# EAGLE design umotion_2_v1.2_pcb_1 (EAGLE 9.5.2)

## Sheet 1 of 2
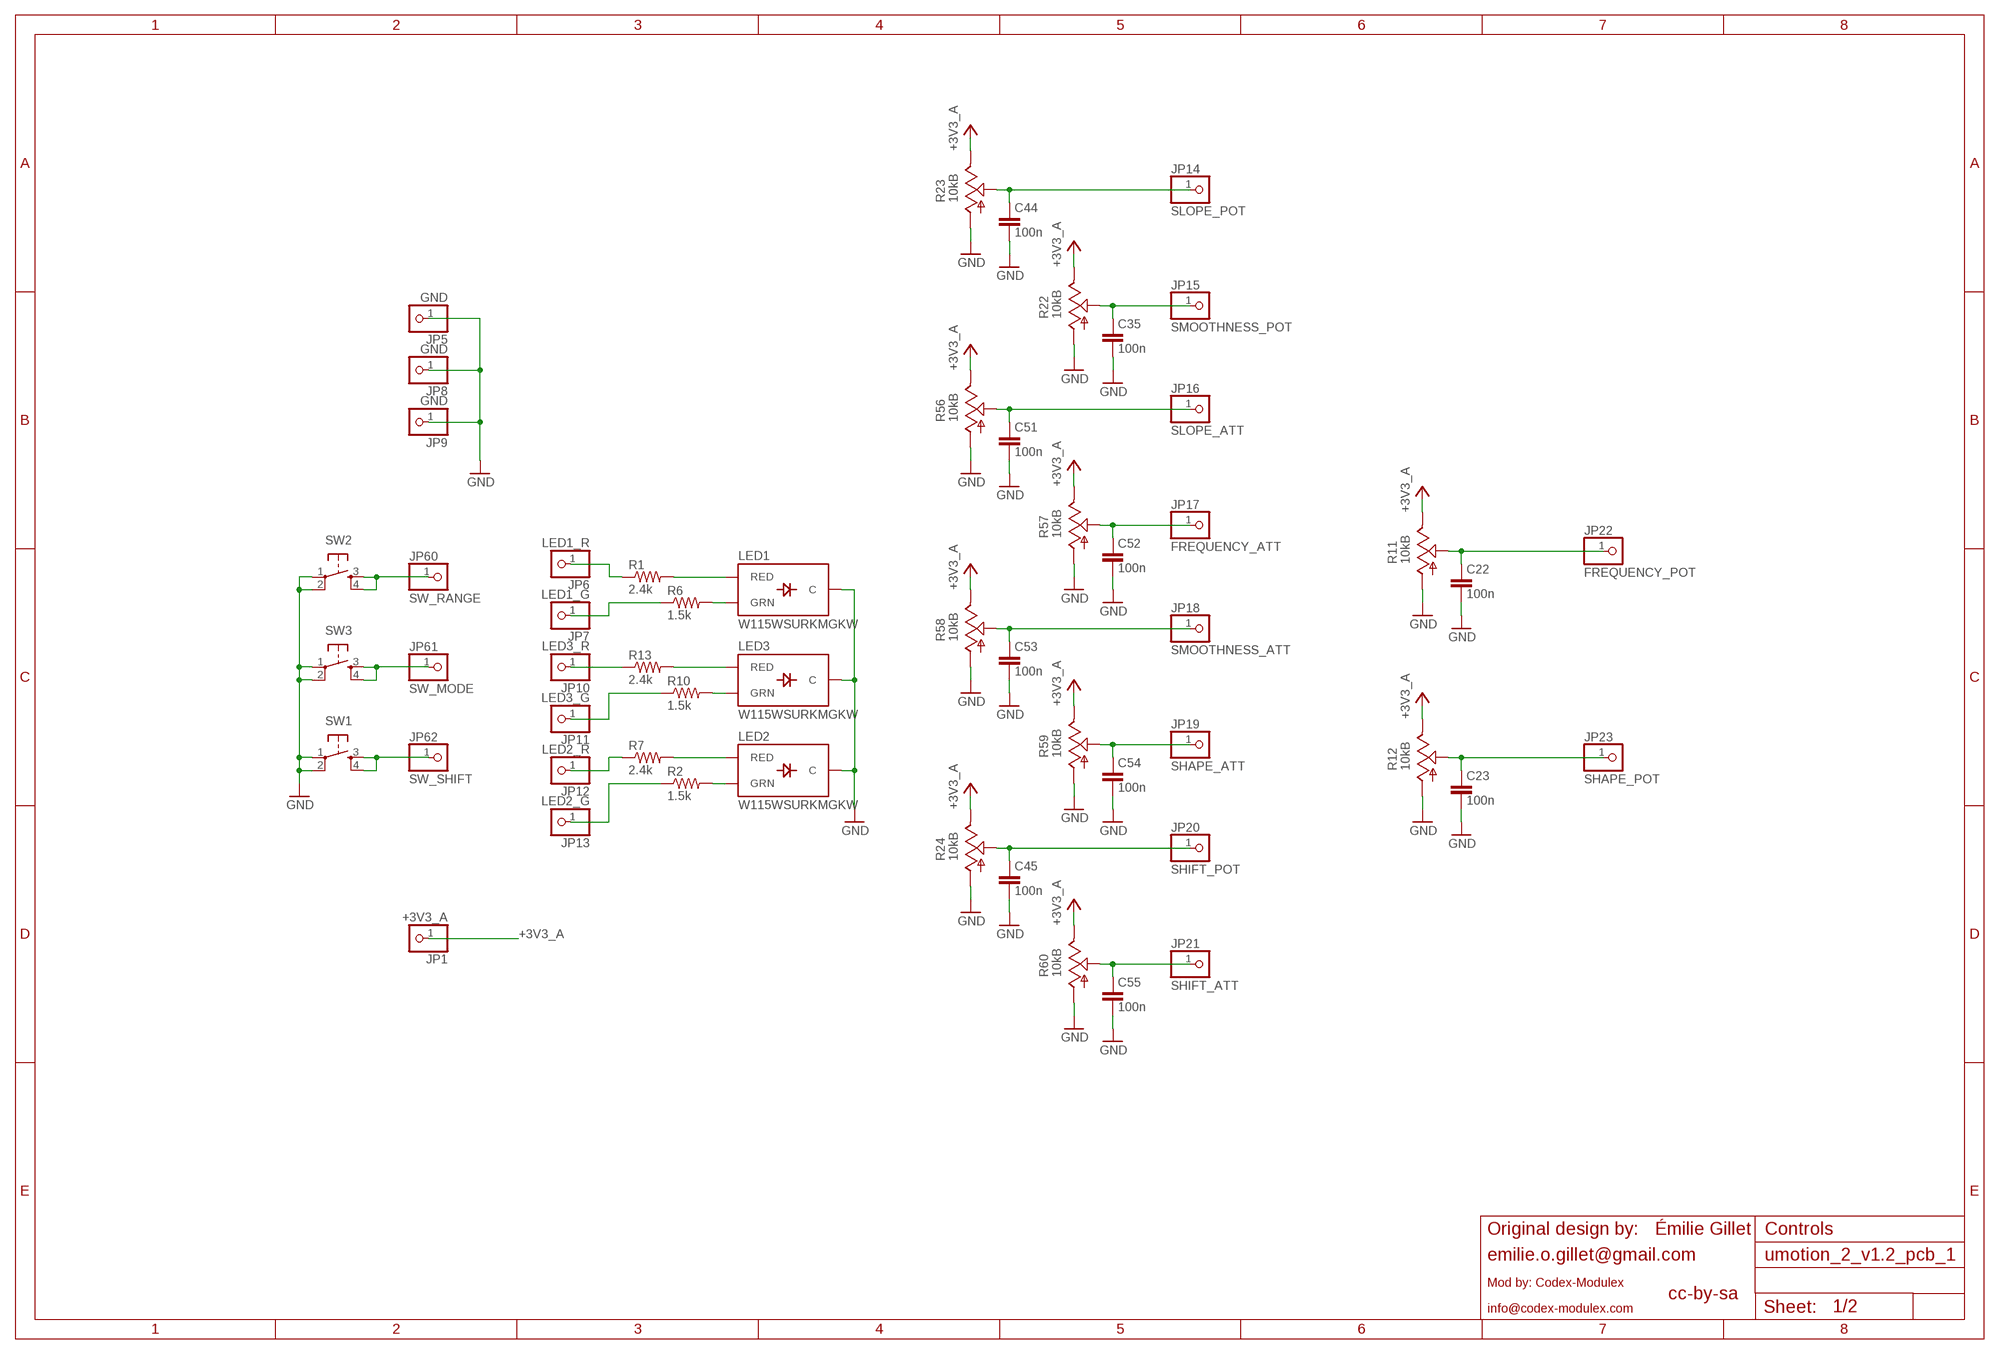
[diagram p0: schematic, sheet 1]

### Parts
C22  100n  PARTS_AMAN_CAPACITOR  [PARTS_AMAN_RESISTOR_0603]
C23  100n  PARTS_AMAN_CAPACITOR  [PARTS_AMAN_RESISTOR_0603]
C35  100n  PARTS_AMAN_CAPACITOR  [PARTS_AMAN_RESISTOR_0603]
C44  100n  PARTS_AMAN_CAPACITOR  [PARTS_AMAN_RESISTOR_0603]
C45  100n  PARTS_AMAN_CAPACITOR  [PARTS_AMAN_RESISTOR_0603]
C51  100n  PARTS_AMAN_CAPACITOR  [PARTS_AMAN_RESISTOR_0603]
C52  100n  PARTS_AMAN_CAPACITOR  [PARTS_AMAN_RESISTOR_0603]
C53  100n  PARTS_AMAN_CAPACITOR  [PARTS_AMAN_RESISTOR_0603]
C54  100n  PARTS_AMAN_CAPACITOR  [PARTS_AMAN_RESISTOR_0603]
C55  100n  PARTS_AMAN_CAPACITOR  [PARTS_AMAN_RESISTOR_0603]
JP1  +3V3_A  PARTS_AMAN_PINHD-1X1  [PARTS_AMAN_1X01]
JP5  GND  PARTS_AMAN_PINHD-1X1  [PARTS_AMAN_1X01]
JP6  LED1_R  PARTS_AMAN_PINHD-1X1  [PARTS_AMAN_1X01]
JP7  LED1_G  PARTS_AMAN_PINHD-1X1  [PARTS_AMAN_1X01]
JP8  GND  PARTS_AMAN_PINHD-1X1  [PARTS_AMAN_1X01]
JP9  GND  PARTS_AMAN_PINHD-1X1  [PARTS_AMAN_1X01]
JP10  LED3_R  PARTS_AMAN_PINHD-1X1  [PARTS_AMAN_1X01]
JP11  LED3_G  PARTS_AMAN_PINHD-1X1  [PARTS_AMAN_1X01]
JP12  LED2_R  PARTS_AMAN_PINHD-1X1  [PARTS_AMAN_1X01]
JP13  LED2_G  PARTS_AMAN_PINHD-1X1  [PARTS_AMAN_1X01]
JP14  SLOPE_POT  PARTS_AMAN_PINHD-1X1  [PARTS_AMAN_1X01]
JP15  SMOOTHNESS_POT  PARTS_AMAN_PINHD-1X1  [PARTS_AMAN_1X01]
JP16  SLOPE_ATT  PARTS_AMAN_PINHD-1X1  [PARTS_AMAN_1X01]
JP17  FREQUENCY_ATT  PARTS_AMAN_PINHD-1X1  [PARTS_AMAN_1X01]
JP18  SMOOTHNESS_ATT  PARTS_AMAN_PINHD-1X1  [PARTS_AMAN_1X01]
JP19  SHAPE_ATT  PARTS_AMAN_PINHD-1X1  [PARTS_AMAN_1X01]
JP20  SHIFT_POT  PARTS_AMAN_PINHD-1X1  [PARTS_AMAN_1X01]
JP21  SHIFT_ATT  PARTS_AMAN_PINHD-1X1  [PARTS_AMAN_1X01]
JP22  FREQUENCY_POT  PARTS_AMAN_PINHD-1X1  [PARTS_AMAN_1X01]
JP23  SHAPE_POT  PARTS_AMAN_PINHD-1X1  [PARTS_AMAN_1X01]
JP60  SW_RANGE  PARTS_AMAN_PINHD-1X1  [PARTS_AMAN_1X01]
JP61  SW_MODE  PARTS_AMAN_PINHD-1X1  [PARTS_AMAN_1X01]
JP62  SW_SHIFT  PARTS_AMAN_PINHD-1X1  [PARTS_AMAN_1X01]
LED1  W115WSURKMGKW  LED-BICOLOR-THROUGHHOLE2.54  [LED-BICOLOR-THROUGHHOLE-2.54]
LED2  W115WSURKMGKW  LED-BICOLOR-THROUGHHOLE2.54  [LED-BICOLOR-THROUGHHOLE-2.54]
LED3  W115WSURKMGKW  LED-BICOLOR-THROUGHHOLE2.54  [LED-BICOLOR-THROUGHHOLE-2.54]
R1  2.4k  PARTS_AMAN_RESISTOR  [PARTS_AMAN_RESISTOR_0603]
R2  1.5k  PARTS_AMAN_RESISTOR  [PARTS_AMAN_RESISTOR_0603]
R6  1.5k  PARTS_AMAN_RESISTOR  [PARTS_AMAN_RESISTOR_0603]
R7  2.4k  PARTS_AMAN_RESISTOR  [PARTS_AMAN_RESISTOR_0603]
R10  1.5k  PARTS_AMAN_RESISTOR  [PARTS_AMAN_RESISTOR_0603]
R11  10kB  POT_USVERTICAL  [ALPS_POT_VERTICAL]
R12  10kB  POT_USVERTICAL  [ALPS_POT_VERTICAL]
R13  2.4k  PARTS_AMAN_RESISTOR  [PARTS_AMAN_RESISTOR_0603]
R22  10kB  POT_USVERTICAL  [ALPS_POT_VERTICAL]
R23  10kB  POT_USVERTICAL  [ALPS_POT_VERTICAL]
R24  10kB  POT_USVERTICAL  [ALPS_POT_VERTICAL]
R56  10kB  POT_USVERTICAL  [ALPS_POT_VERTICAL]
R57  10kB  POT_USVERTICAL  [ALPS_POT_VERTICAL]
R58  10kB  POT_USVERTICAL  [ALPS_POT_VERTICAL]
R59  10kB  POT_USVERTICAL  [ALPS_POT_VERTICAL]
R60  10kB  POT_USVERTICAL  [ALPS_POT_VERTICAL]
SW1  TAC_SWITCHPTH  [TACTILE-PTH]
SW2  TAC_SWITCHPTH  [TACTILE-PTH]
SW3  TAC_SWITCHPTH  [TACTILE-PTH]

### Nets
+3V3_A: JP1.1 R11.P$1(E) R12.P$1(E) R22.P$1(E) R23.P$1(E) R24.P$1(E) R56.P$1(E) R57.P$1(E) R58.P$1(E) R59.P$1(E) R60.P$1(E)
GND: C22.2 C23.2 C35.2 C44.2 C45.2 C51.2 C52.2 C53.2 C54.2 C55.2 JP5.1 JP8.1 JP9.1 LED1.2(C) LED2.2(C) LED3.2(C) R11.P$3(A) R12.P$3(A) R22.P$3(A) R23.P$3(A) R24.P$3(A) R56.P$3(A) R57.P$3(A) R58.P$3(A) R59.P$3(A) R60.P$3(A) SW1.1 SW1.2 SW2.1 SW2.2 SW3.1 SW3.2 ; also sheet 2
LED_MODE_G: JP11.1 R10.1
LED_MODE_R: JP10.1 R13.1
LED_RANGE_G: JP7.1 R6.1
LED_RANGE_R: JP6.1 R1.1
LED_SHIFT_G: JP13.1 R2.1
LED_SHIFT_R: JP12.1 R7.1
N$1: C44.1 JP14.1 R23.P$2(S)
N$5: C35.1 JP15.1 R22.P$2(S)
N$6: C51.1 JP16.1 R56.P$2(S)
N$7: C52.1 JP17.1 R57.P$2(S)
N$8: C53.1 JP18.1 R58.P$2(S)
N$9: C54.1 JP19.1 R59.P$2(S)
N$10: C45.1 JP20.1 R24.P$2(S)
N$11: C55.1 JP21.1 R60.P$2(S)
N$16: LED1.3(RED) R1.2
N$18: LED3.3(RED) R13.2
N$20: LED3.1(GRN) R10.2
N$21: LED2.3(RED) R7.2
N$22: LED1.1(GRN) R6.2
N$23: LED2.1(GRN) R2.2
N$30: C22.1 JP22.1 R11.P$2(S)
N$31: C23.1 JP23.1 R12.P$2(S)
SW_MODE: JP61.1 SW3.3 SW3.4
SW_RANGE: JP60.1 SW2.3 SW2.4
SW_SHIFT: JP62.1 SW1.3 SW1.4

### Notes on the sheet
- Original design by: | Émilie Gillet | Controls
- emilie.o.gillet@gmail.com
- Mod by: Codex-Modulex
- cc-by-sa
- info@codex-modulex.com

## Sheet 2 of 2
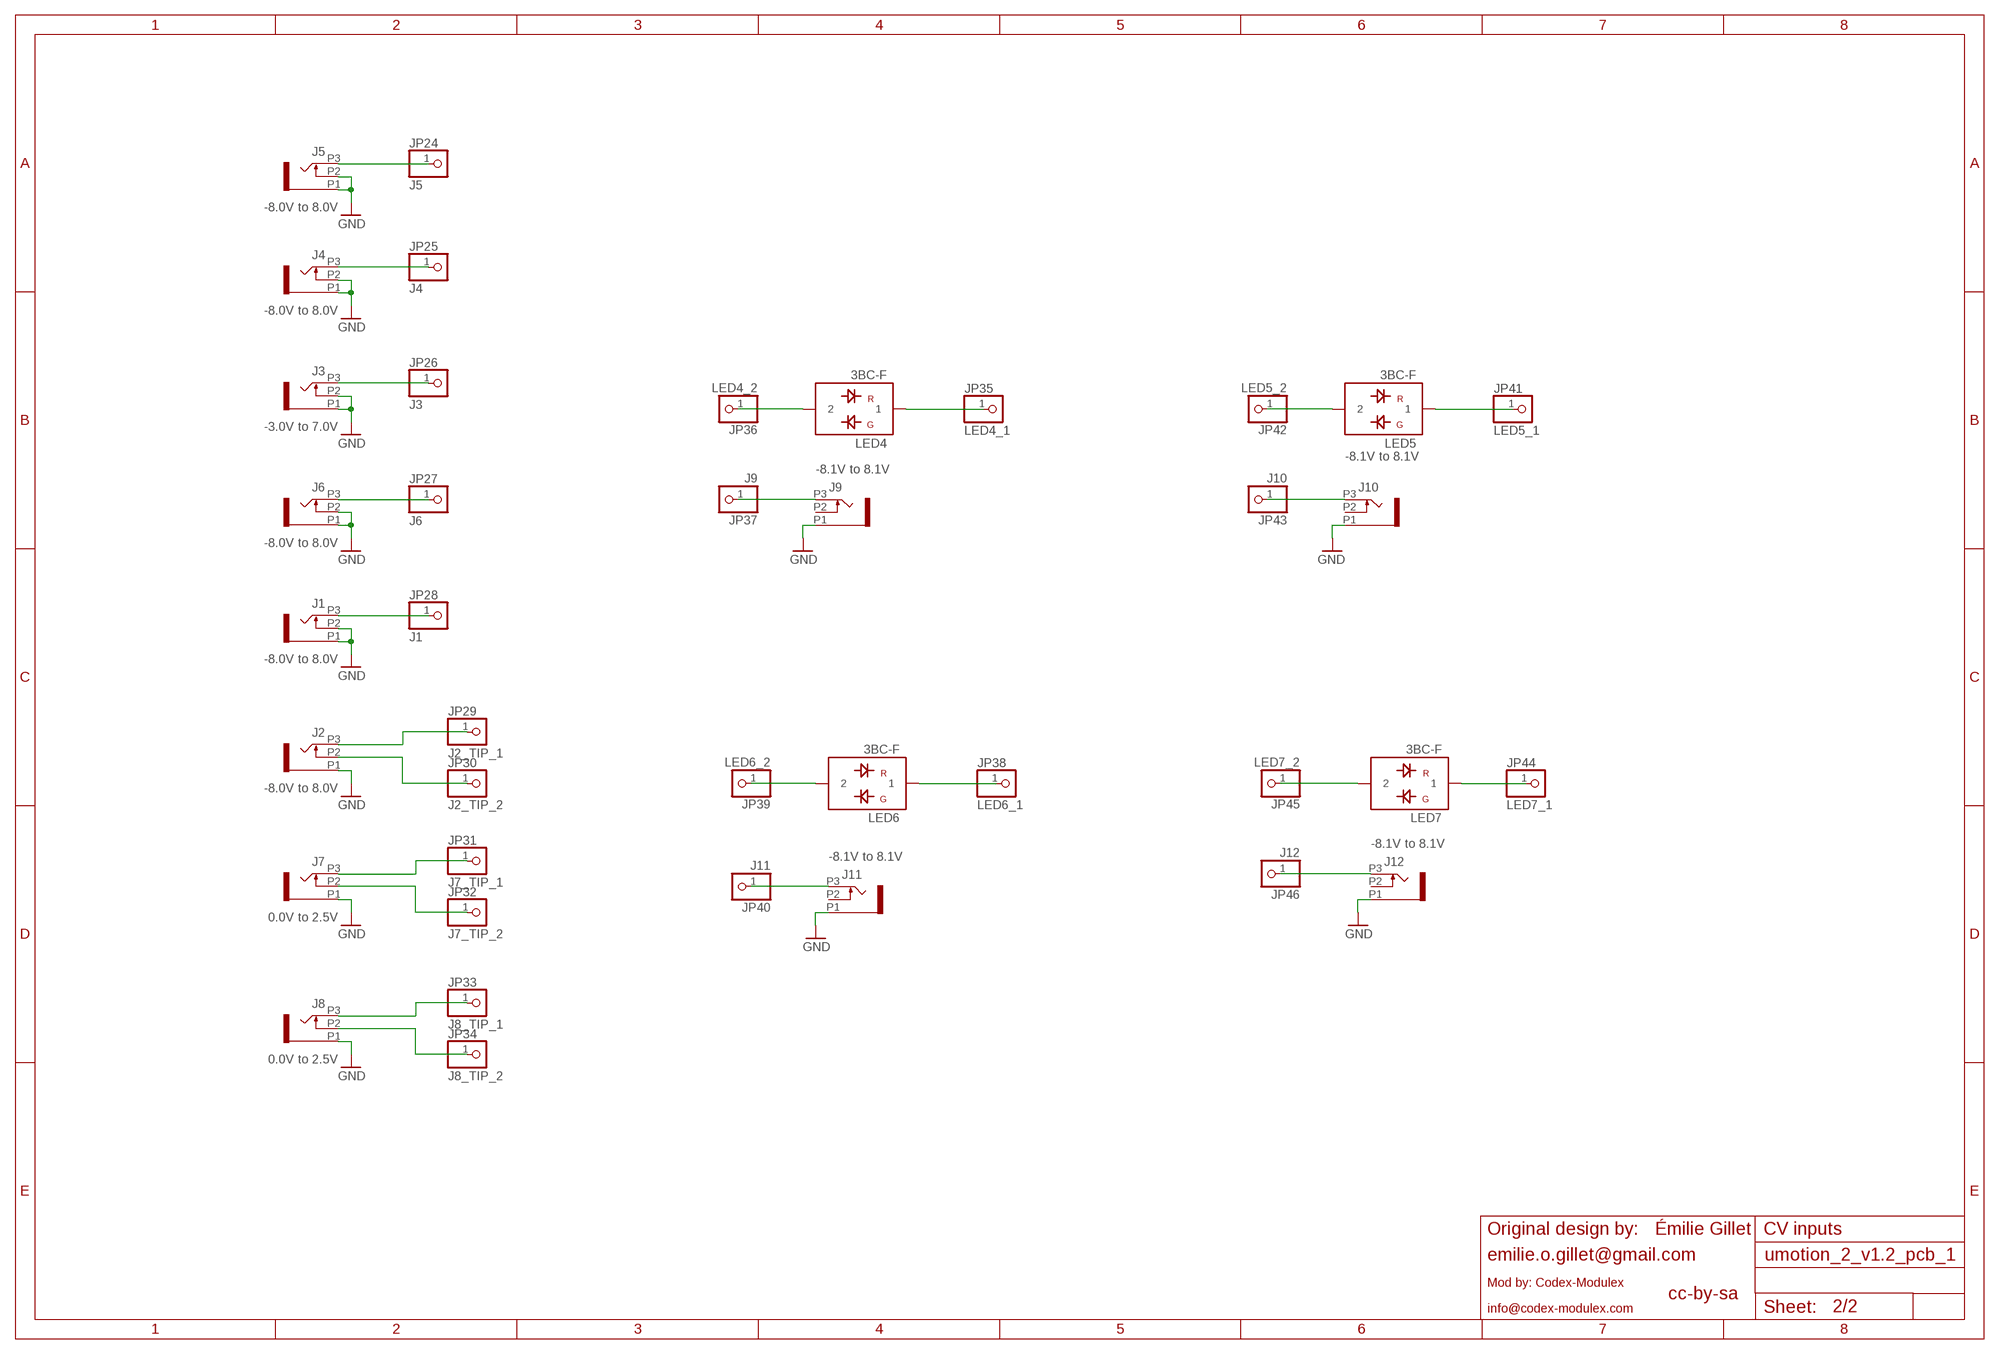
[diagram p1: schematic, sheet 2]

### Parts
J1  PJ301_THONKICONN6  [WQP_PJ_301M6]
J2  PJ301_THONKICONN6  [WQP_PJ_301M6]
J3  PJ301_THONKICONN6  [WQP_PJ_301M6]
J4  PJ301_THONKICONN6  [WQP_PJ_301M6]
J5  PJ301_THONKICONN6  [WQP_PJ_301M6]
J6  PJ301_THONKICONN6  [WQP_PJ_301M6]
J7  PJ301_THONKICONN6  [WQP_PJ_301M6]
J8  PJ301_THONKICONN6  [WQP_PJ_301M6]
J9  PJ301_THONKICONN6  [WQP_PJ_301M6]
J10  PJ301_THONKICONN6  [WQP_PJ_301M6]
J11  PJ301_THONKICONN6  [WQP_PJ_301M6]
J12  PJ301_THONKICONN6  [WQP_PJ_301M6]
JP24  J5  PARTS_AMAN_PINHD-1X1  [PARTS_AMAN_1X01]
JP25  J4  PARTS_AMAN_PINHD-1X1  [PARTS_AMAN_1X01]
JP26  J3  PARTS_AMAN_PINHD-1X1  [PARTS_AMAN_1X01]
JP27  J6  PARTS_AMAN_PINHD-1X1  [PARTS_AMAN_1X01]
JP28  J1  PARTS_AMAN_PINHD-1X1  [PARTS_AMAN_1X01]
JP29  J2_TIP_1  PARTS_AMAN_PINHD-1X1  [PARTS_AMAN_1X01]
JP30  J2_TIP_2  PARTS_AMAN_PINHD-1X1  [PARTS_AMAN_1X01]
JP31  J7_TIP_1  PARTS_AMAN_PINHD-1X1  [PARTS_AMAN_1X01]
JP32  J7_TIP_2  PARTS_AMAN_PINHD-1X1  [PARTS_AMAN_1X01]
JP33  J8_TIP_1  PARTS_AMAN_PINHD-1X1  [PARTS_AMAN_1X01]
JP34  J8_TIP_2  PARTS_AMAN_PINHD-1X1  [PARTS_AMAN_1X01]
JP35  LED4_1  PARTS_AMAN_PINHD-1X1  [PARTS_AMAN_1X01]
JP36  LED4_2  PARTS_AMAN_PINHD-1X1  [PARTS_AMAN_1X01]
JP37  J9  PARTS_AMAN_PINHD-1X1  [PARTS_AMAN_1X01]
JP38  LED6_1  PARTS_AMAN_PINHD-1X1  [PARTS_AMAN_1X01]
JP39  LED6_2  PARTS_AMAN_PINHD-1X1  [PARTS_AMAN_1X01]
JP40  J11  PARTS_AMAN_PINHD-1X1  [PARTS_AMAN_1X01]
JP41  LED5_1  PARTS_AMAN_PINHD-1X1  [PARTS_AMAN_1X01]
JP42  LED5_2  PARTS_AMAN_PINHD-1X1  [PARTS_AMAN_1X01]
JP43  J10  PARTS_AMAN_PINHD-1X1  [PARTS_AMAN_1X01]
JP44  LED7_1  PARTS_AMAN_PINHD-1X1  [PARTS_AMAN_1X01]
JP45  LED7_2  PARTS_AMAN_PINHD-1X1  [PARTS_AMAN_1X01]
JP46  J12  PARTS_AMAN_PINHD-1X1  [PARTS_AMAN_1X01]
LED4  3BC-F  LED-BICOLOR-SHARED-THROUGHHOLE  [LED3MM]
LED5  3BC-F  LED-BICOLOR-SHARED-THROUGHHOLE  [LED3MM]
LED6  3BC-F  LED-BICOLOR-SHARED-THROUGHHOLE  [LED3MM]
LED7  3BC-F  LED-BICOLOR-SHARED-THROUGHHOLE  [LED3MM]

### Nets
CLOCK_IN: J8.P3 JP33.1
FM_IN: J2.P3 JP29.1
GND: J1.P1 J1.P2 J2.P1 J3.P1 J3.P2 J4.P1 J4.P2 J5.P1 J5.P2 J6.P1 J6.P2 J7.P1 J8.P1 J9.P1 J10.P1 J11.P1 J12.P1 ; also sheet 1
N$2: J7.P2 JP32.1
N$3: J8.P2 JP34.1
N$4: J9.P3 JP37.1
N$12: JP36.1 LED4.2
N$13: JP35.1 LED4.1
N$14: J11.P3 JP40.1
N$15: JP39.1 LED6.2
N$17: JP38.1 LED6.1
N$19: J10.P3 JP43.1
N$24: JP42.1 LED5.2
N$25: JP41.1 LED5.1
N$26: J2.P2 JP30.1
N$27: J12.P3 JP46.1
N$28: JP45.1 LED7.2
N$29: JP44.1 LED7.1
SHAPE_IN: J5.P3 JP24.1
SHIFT_IN: J6.P3 JP27.1
SLOPE_IN: J1.P3 JP28.1
SMOOTHNESS_IN: J4.P3 JP25.1
TRIG_IN: J7.P3 JP31.1
V_OCT_IN: J3.P3 JP26.1
Unconnected: J9.P2 J10.P2 J11.P2 J12.P2

### Notes on the sheet
- -8.0V to 8.0V
- -8.0V to 8.0V
- -3.0V to 7.0V
- -8.1V to 8.1V
- -8.1V to 8.1V
- -8.0V to 8.0V
- -8.0V to 8.0V
- -8.0V to 8.0V
- -8.1V to 8.1V
- -8.1V to 8.1V
- 0.0V to 2.5V
- 0.0V to 2.5V
- Original design by: | Émilie Gillet | CV inputs
- emilie.o.gillet@gmail.com
- Mod by: Codex-Modulex
- cc-by-sa
- info@codex-modulex.com

## Library data of the parts
C22 C23 C35 C44 C45 C51-C55 = atom_v1_1_board_2:PARTS_AMAN_CAPACITOR
J1-J8 = og-pj301_variations:PJ301_THONKICONN
J9-J12 = og-pj301:PJ301_THONKICONN
JP1 JP5-JP46 JP60-JP62 = atom_v1_1_board_2:PARTS_AMAN_PINHD-1X1: PIN HEADER
LED1-LED3 = og-leds:LED-BICOLOR-THROUGHHOLE
LED4-LED7 = og-leds:LED-BICOLOR-SHARED-THROUGHHOLE
R1 R2 R6 R7 R10 R13 = atom_v1_1_board_2:PARTS_AMAN_RESISTOR
R11 R12 R22-R24 R56-R60 = og-pots:POT_US
SW1-SW3 = SparkFun:TAC_SWITCH: Momentary Switch Button commonly used for reset or general input. Spark Fun Electronics SKU : COM-00097

## Board
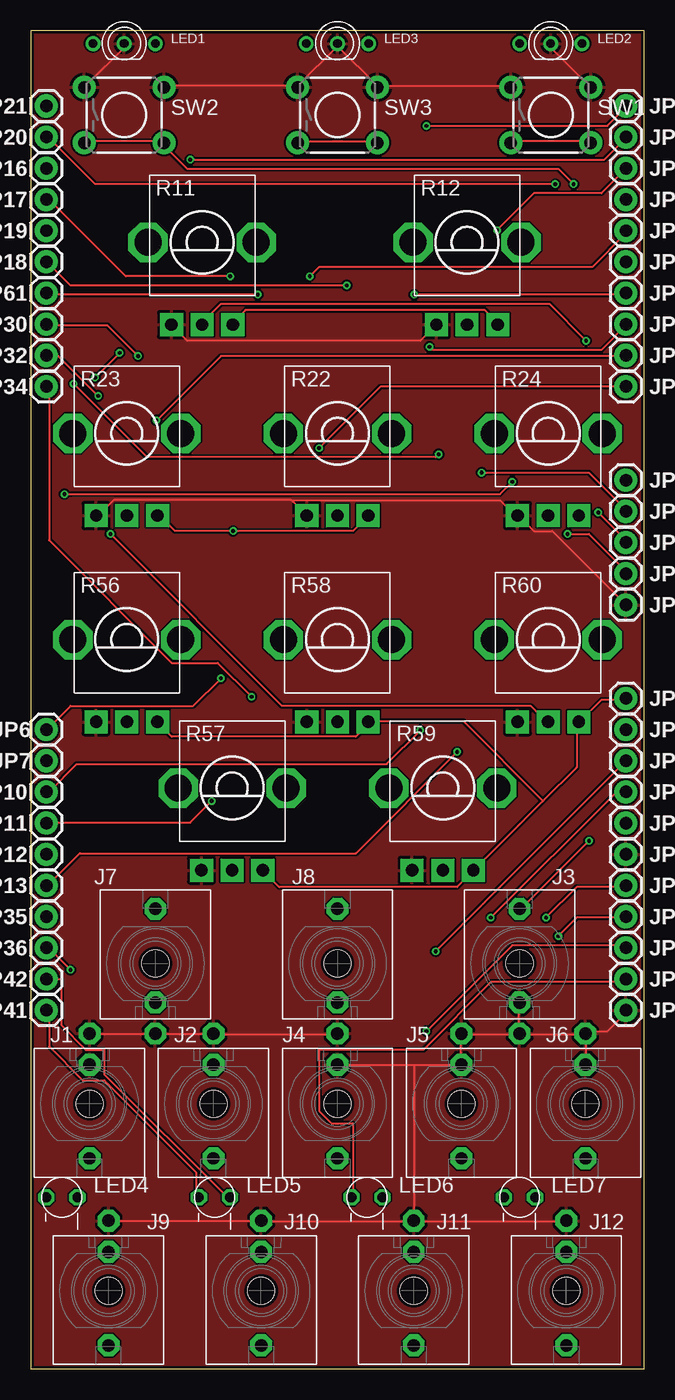
[diagram p2: board, top side]
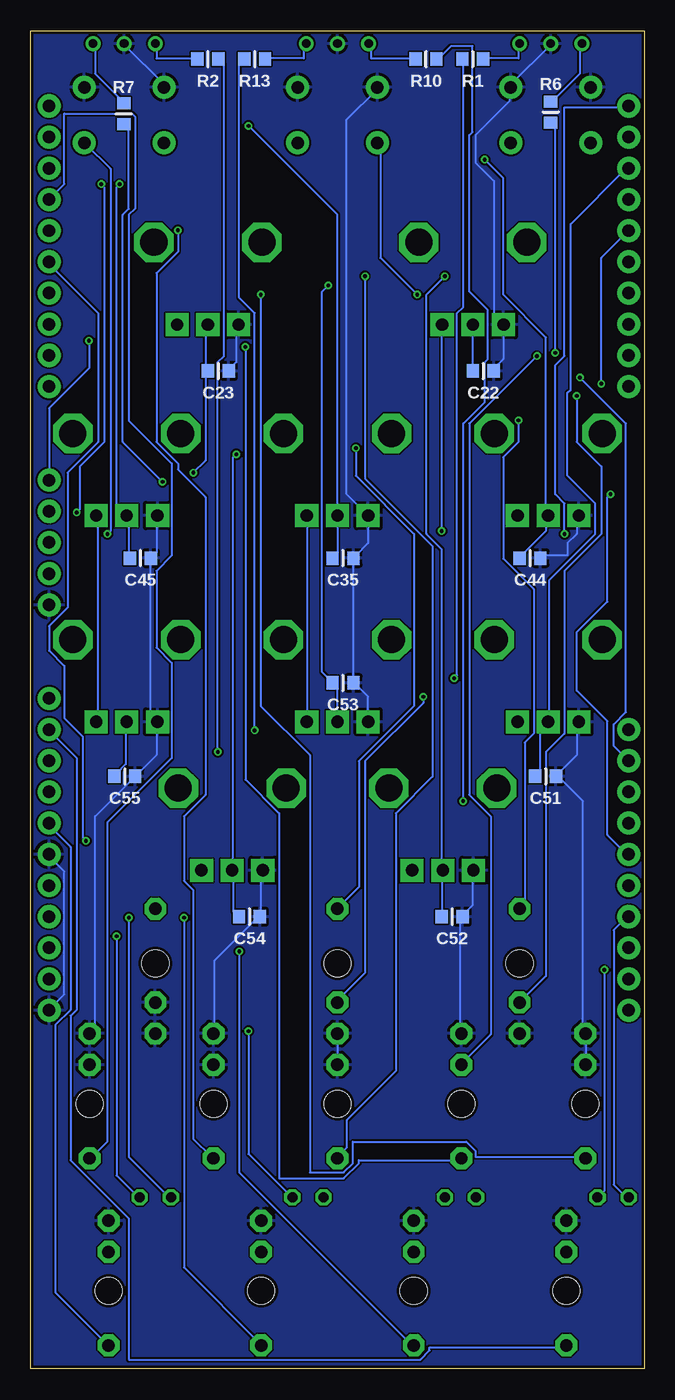
[diagram p3: board, bottom side, seen from below]

Size 50 x 109 mm. Coordinates in mm from the lower left corner, seen from the top.
Outline: 0,0 50,0 50,109 0,109 0,0
Copper layers (1*16): Top 0.035mm / dielectric 1.5mm / Bottom 0.035mm
Design rules "dirt_cheap_dirty_boards.v1.1": minimum track width 6mil, minimum drill 12mil, track to track 6mil, track to pad 6mil, pad to pad 6mil, via to via 6mil, smd to smd 0mil, copper to edge 10mil, drill to drill 10mil, minimum pad ring 10mil, minimum via ring 6mil, stop-mask expansion 2mil, vias tented up to drill 25mil, thermal gap 10mil

### Footprints (pad centres in the part's own frame; a part is rotated, then mirrored left to right if it is on the bottom)
PARTS_AMAN_RESISTOR_0603 = smd 1 x 1.1: 1 -0.85,0; 2 0.85,0
WQP_PJ_301M6 = drill 1.016 pad 1.778 octagon: P1 0,-5.715; P2 0,-3.175; P3 0,4.445 | hole 2.2: 0,0
PARTS_AMAN_1X01 = drill 1.016 pad 1.88: 1 0,0
LED-BICOLOR-THROUGHHOLE-2.54 = drill 0.7: 1 -2.54,0; 2 0,0; 3 2.54,0
LED3MM = drill 0.813 octagon: 1 -1.27,0; 2 1.27,0
ALPS_POT_VERTICAL = drill 1 pad 1.88 square: P$1 -2.5,6.7; P$2 0,6.7; P$3 2.5,6.7 | drill 2.2 pad 3.175 octagon: P$4 -4.4,0; P$5 4.4,0
TACTILE-PTH = drill 1.016 pad 1.88: 1 -3.251,2.261; 2 3.251,2.261; 3 -3.251,-2.261; 4 3.251,-2.261

### Placement (x,y rotation side)
C22  13.12,81.28 0 bottom
C23  34.71,81.28 0 bottom
C35  24.55,66.04 0 bottom
C44  9.31,66.04 0 bottom
C45  41.06,66.04 0 bottom
C51  8.04,48.26 0 bottom
C52  15.66,36.83 0 bottom
C53  24.55,55.88 0 bottom
C54  32.17,36.83 0 bottom
C55  42.33,48.26 0 bottom
J1  4.8,21.59 180 top
J2  14.9,21.59 180 top
J3  39.84,33.02 0 top
J4  25,21.59 180 top
J5  35.1,21.59 180 top
J6  45.2,21.59 180 top
J7  10.16,33.02 0 top
J8  25,33.02 0 top
J9  6.35,6.35 180 top
J10  18.78,6.35 180 top
J11  31.22,6.35 180 top
J12  43.65,6.35 180 top
JP1  48.5,54.61 0 top
JP5  48.5,62.23 0 top
JP6  1.27,52.07 0 top
JP7  1.27,49.53 0 top
JP8  48.5,41.91 0 top
JP9  48.5,29.21 0 top
JP10  1.27,46.99 0 top
JP11  1.27,44.45 0 top
JP12  1.27,41.91 0 top
JP13  1.27,39.37 0 top
JP14  48.5,100.33 0 top
JP15  48.5,102.87 0 top
JP16  1.27,97.79 0 top
JP17  1.27,95.25 0 top
JP18  1.27,90.17 0 top
JP19  1.27,92.71 0 top
JP20  1.27,100.33 0 top
JP21  1.27,102.87 0 top
JP22  48.5,72.39 0 top
JP23  48.5,69.85 0 top
JP24  48.5,97.79 0 top
JP25  48.5,92.71 0 top
JP26  48.5,90.17 0 top
JP27  48.5,95.25 0 top
JP28  48.5,87.63 0 top
JP29  48.5,85.09 0 top
JP30  1.27,85.09 0 top
JP31  48.5,82.55 0 top
JP32  1.27,82.55 0 top
JP33  48.5,80.01 0 top
JP34  1.27,80.01 0 top
JP35  1.27,36.83 0 top
JP36  1.27,34.29 0 top
JP37  48.5,52.07 0 top
JP38  48.5,31.75 0 top
JP39  48.5,34.29 0 top
JP40  48.5,46.99 0 top
JP41  1.27,29.21 0 top
JP42  1.27,31.75 0 top
JP43  48.5,49.53 0 top
JP44  48.5,39.37 0 top
JP45  48.5,36.83 0 top
JP46  48.5,44.45 0 top
JP60  48.5,67.31 0 top
JP61  1.27,87.63 0 top
JP62  48.5,64.77 0 top
LED1  7.62,107.95 0 top
LED2  42.38,107.95 0 top
LED3  25,107.95 0 top
LED4  2.54,13.97 0 top
LED5  14.97,13.97 0 top
LED6  27.41,13.97 0 top
LED7  39.84,13.97 0 top
R1  13.97,106.68 0 bottom
R2  35.56,106.68 180 bottom
R6  7.62,102.36 90 bottom
R7  42.42,102.23 90 bottom
R10  17.78,106.68 180 bottom
R11  13.97,91.76 180 top
R12  35.56,91.76 180 top
R13  31.75,106.68 0 bottom
R22  25,76.2 180 top
R23  7.83,76.2 180 top
R24  42.17,76.2 180 top
R56  7.83,59.4 180 top
R57  16.41,47.31 180 top
R58  25,59.4 180 top
R59  33.59,47.31 180 top
R60  42.17,59.4 180 top
SW1  42.38,102.13 0 top
SW2  7.62,102.13 0 top
SW3  25,102.13 0 top

### Tracks (layer width: path | path; a pad name or v marks a point on that pad's centre or on a via)
+3V3_A  (via drill 0.3)
  Top 0.152: R57.P$1 19,40.5 20.25,39.25 34.75,39.25 36,40.5 R59.P$1 36.25,40.75 41.75,46.25 | JP1.1 48.5,54.5 46.5,54.5 44.75,52.75 R60.P$1 44.5,52.5 44.5,49 41.75,46.25 | R11.P$1 16.5,85.25 17.5,86.25 37,86.25 38,85.25 R12.P$1 | R56.P$1 10.5,52.5 11.5,51.5 26.5,51.5 27.5,52.5 R58.P$1 27.5,52.75 35.25,52.75 41.75,46.25 | R22.P$1 26.25,68.25 v16.5,68.25 11.75,68.25 10.5,69.5 R23.P$1
  Bottom 0.152: R24.P$1 44.5,69.5 44.5,52.75 R60.P$1 | R22.P$1 R58.P$1 | v16.5,68.25 16.5,85 R11.P$1
CLOCK_IN  (via drill 0.3)
  Top 0.152: v23.5,75 28.5,80 JP33.1
  Bottom 0.152: v23.5,75 23.5,72.75 18.75,68 18.75,54 23.25,49.5 23.25,39.25 25,37.5 J8.P3
FM_IN  (via drill 0.3)
  Top 0.152: v32.5,83.25 32.75,83 46.5,83 48.5,85 JP29.1
  Bottom 0.152: v32.5,83.25 32.5,48 29.75,45.25 29.75,15.5 24.5,15.5 23.25,16.75 23.25,17 15,17 J2.P3
GND
  Top 0.152: R11.P$3 11.5,85 12.75,83.75 31.75,83.75 33,85 R12.P$3 | SW1.2 45.5,104.5 42.25,107.75 LED2.2 | SW2.1 4.5,104.5 7.75,107.75 LED1.2 | 25,107.75 21.75,104.5 SW3.1 21.5,104.5 11,104.5 SW2.2 | 25,107.75 28.25,104.5 SW3.2 28.5,104.5 39,104.5 SW1.1 | 25,107.75 LED3.2 | JP5.1 48.5,62.25 42.5,68.25 41,68.25 39.75,69.5 R24.P$3 39.5,69.5 38.25,70.75 21.25,70.75 | 21.25,70.75 6.75,70.75 5.5,69.5 R23.P$3 | R22.P$3 21.25,70.75 | J9.P1 6.5,12 18.75,12 J10.P1 19,12 31,12 J11.P1 | J12.P1 43.5,12 31.25,12 J11.P1 | J6.P2 45.25,25 45.25,27.25 J6.P1 | JP9.1 48.5,29 47,27.5 45.25,27.5 J6.P1 | J3.P1 39.75,27.5 39.75,29.75 J3.P2 | J3.P1 39.75,27.25 35.25,27.25 J5.P1 35,27.25 35,25 J5.P2 35,24.75 31.25,24.75 | J6.P1 45,27.25 40,27.25 J3.P1 | J1.P1 5,27.25 10,27.25 J7.P1 10.25,27.25 14.75,27.25 J2.P1 15,27.25 25,27.25 J4.P1 | 31.25,24.75 25,24.75 J4.P2 | 31.25,24.75 31.25,12.25 J11.P1
  Bottom 0.152: C22.2 12.25,81.5 11.5,82.25 11.5,85 R11.P$3 11.5,85.25 12.25,86 12.25,96.75 13.75,98.25 13.75,100.5 11,103.25 11,104.25 SW2.2 10.75,104.5 10.75,104.75 7.75,107.75 LED1.2 | C23.2 33.75,81.5 33.25,82 33.25,85 R12.P$3 | LED2.2 42.25,107.75 39.25,104.75 39.25,104.5 SW1.1 | R24.P$3 39.75,69.5 39.75,66.5 C45.2 40.25,66 40.25,53.25 39.75,52.75 R60.P$3 39.75,52.5 39.75,50 41.25,48.5 C55.2 41.5,48.25 44.75,45 44.75,27.75 45,27.5 J6.P1 | C44.2 8.25,66.25 6.25,66.25 6.25,67.25 5.5,68 5.5,69.5 R23.P$3 | R58.P$3 22.5,54.75 23.5,55.75 C53.2 23.75,56 23.75,66 C35.2 23.5,66.25 22.5,67.25 R22.P$3 24.25,71.25 24.25,101.75 21.75,104.25 SW3.1 | JP8.1 48.5,41.75 47.25,40.5 47.25,30.5 48.5,29.25 JP9.1 | R59.P$3 31.25,40.5 31.25,37 C54.2 31.5,36.75 35,33.25 35,27.5 J5.P1 | R56.P$3 5.5,52.5 5.5,50 7,48.5 C51.2 7,48.25 5,46.25 5,27.5 J1.P1 4.75,27.25 4.75,25 J1.P2 | J4.P1 J4.P2 | R57.P$3 14,40.5 14,37.75 14.75,37 C52.2 15,36.75 15,27.5 J2.P1
  pour Top (isolate 0.012): 0,108.97 50.04,108.97 50.04,0 0,0
  pour Bottom (isolate 0.012): 0,108.97 50.04,108.97 50.04,0 0,0
LED_MODE_G  (via drill 0.3)
  Top 0.152: v14.75,46.25 13,44.5 1.5,44.5 JP11.1
  Bottom 0.152: v14.75,46.25 14.75,77 13,78.75 13,82 12.75,82.25 12.75,86.25 14.25,87.75 14.25,100.5 14,100.75 14,107.75 15.75,107.75 16.75,106.75 R10.1
LED_MODE_R  (via drill 0.3)
  Top 0.152: v31.75,52 29,49.25 3.75,49.25 1.5,47 JP10.1
  Bottom 0.152: v31.75,52 31.75,86 33,87.25 33,106.25 32.75,106.5 R13.1
LED_RANGE_G  (via drill 0.3)
  Top 0.152: v5.25,80.75 v7.25,82.75
  Bottom 0.152: v7.25,82.75 7.25,101.25 7.5,101.5 R6.1 | v5.25,80.75 1.5,77 1.5,53.5 2.5,52.5 2.5,50.75 1.5,49.75 JP7.1
LED_RANGE_R  (via drill 0.3)
  Top 0.152: v15.5,56.25 13.25,54 3.25,54 1.5,52.25 JP6.1
  Bottom 0.152: v15.5,56.25 15.25,56.5 15.25,86 14.75,86.5 14.75,106.5 R1.1
LED_SHIFT_G  (via drill 0.3)
  Top 0.152: v34.75,50.25 26.5,42 4,42 1.5,39.5 JP13.1
  Bottom 0.152: v34.75,50.25 34.75,82 34.25,82.5 34.25,106.25 34.5,106.5 R2.1
LED_SHIFT_R  (via drill 0.3)
  Top 0.152: v39.25,72.25 38.25,71.25 v2.75,71.25
  Bottom 0.152: v39.25,72.25 42.5,75.5 42.5,94 42,94.5 42,101 42.25,101.25 R7.1 | v2.75,71.25 3,71 3,62.5 5.5,60 5.5,55.25 3,52.75 3,43.5 1.5,42 JP12.1
N$1  (via drill 0.3)
  Top 0.152: v13,98.5 46.75,98.5 48.5,100.25 JP14.1
  Bottom 0.152: 8,69.5 8,68.25 10,66.25 C44.1 | v13,98.5 11.5,97 11.5,87.5 8,84 8,69.5 | 8,69.5 R23.P$2
N$2  (via drill 0.3)
  Top 0.152: v5.5,79.25 2.25,82.5 1.5,82.5 JP32.1
  Bottom 0.152: v5.5,79.25 5.5,75.5 3.5,73.5 3.5,68 6.5,65 6.5,51.75 8,50.25 8,32 10,30 J7.P2
N$3  (via drill 0.3)
  Top 0.152: v18,54.75 15.25,57.5 11.5,57.5 1.5,67.5 1.5,80 JP34.1
  Bottom 0.152: v18,54.75 18,54.25 22.75,49.5 22.75,32.25 25,30 J8.P2
N$4
  Bottom 0.152: J9.P3 6.5,1.75 17.5,1.75 17.5,1.5 18.25,0.75 42,0.75 42,12.25 46.75,17 46.75,28.75 46.25,29.25 46.25,49.75 48.5,52 JP37.1
N$5  (via drill 0.3)
  Top 0.152: v32.25,101.25 47,101.25 48.5,102.75 JP15.1
  Bottom 0.152: C35.1 25.25,66.25 25,66.5 R22.P$2 25,94 v32.25,101.25
N$6
  Bottom 0.152: C51.1 8.75,48.5 8.5,48.75 8.5,52 8,52.5 R56.P$2 7.75,52.75 7.75,64.25 4,68 4,70.5 6.25,72.75 6.25,79.5 6,79.75 6,93.25 1.5,97.75 JP16.1
N$7  (via drill 0.3)
  Top 0.152: v16.25,89 7.75,89 1.5,95.25 JP17.1
  Bottom 0.152: C52.1 16.5,37 16.5,40.5 R57.P$2 16.5,40.75 16.5,66.75 17.75,68 17.75,87.5 v16.25,89
N$8  (via drill 0.3)
  Top 0.152: v25.75,88.25 3.25,88.25 1.5,90 JP18.1
  Bottom 0.152: R58.P$2 25,55.5 25.25,55.75 C53.1 25.5,56 26.25,56.75 26.25,87.75 v25.75,88.25
N$9  (via drill 0.3)
  Top 0.152: v3.5,80.25 9.5,74.25 33,74.25 v33.25,74.5
  Bottom 0.152: C54.1 33.25,37 33.5,37.25 33.5,40.5 R59.P$2 33.5,40.75 33.5,74.25 v33.25,74.5 | v3.5,80.25 3.5,90.5 1.5,92.5 JP19.1
N$10  (via drill 0.3)
  Top 0.152: v42.75,96.5 5.25,96.5 1.5,100.25 JP20.1
  Bottom 0.152: C45.1 42,66.25 42,69.5 R24.P$2 42.25,69.5 43,70.25 43,96.25 v42.75,96.5
N$11  (via drill 0.3)
  Top 0.152: v6.5,68 20.5,54 40.75,54 42,52.75 R60.P$2
  Bottom 0.152: C55.1 43,48.5 42.25,49.25 42.25,52.5 R60.P$2 | v6.5,68 6.5,70.5 7.25,71.25 7.25,81.75 6.5,82.5 6.5,102.75 1.5,102.75 JP21.1
N$12  (via drill 0.3)
  Top 0.152: v3.25,32.5 1.5,34.25 JP36.1
  Bottom 0.152: v3.25,32.5 3.25,14.5 3.75,14 LED4.2
N$13
  Bottom 0.152: LED4.1 1.5,14 2.5,15 2.5,35.75 1.5,36.75 JP35.1
N$14  (via drill 0.3)
  Top 0.152: v37.5,36.75 47.5,46.75 48.5,46.75 JP40.1
  Bottom 0.152: v37.5,36.75 37.5,8.25 31.25,2 J11.P3
N$15  (via drill 0.3)
  Top 0.152: v32.25,27.5 39.25,34.5 48.5,34.5 JP39.1
  Bottom 0.152: v32.25,27.5 32.25,17.5 28.75,14 LED6.2
N$16
  Bottom 0.152: R1.2 13,106.75 10.25,106.75 10.25,107.75 LED1.3
N$17
  Top 0.152: JP38.1 48.25,31.5 37.5,31.5 32,26 23.5,26 23.5,21 24.5,20 26.25,20 26.25,14 LED6.1
N$18
  Bottom 0.152: R13.2 30.75,106.75 27.75,106.75 27.75,107.75 LED3.3
N$19  (via drill 0.3)
  Top 0.152: v33,34 48.5,49.5 JP43.1
  Bottom 0.152: v33,34 33,16 19,2 J10.P3
N$20
  Bottom 0.152: R10.2 18.75,106.75 22.25,106.75 22.25,107.75 LED3.1
N$21
  Bottom 0.152: R7.2 42.5,103.25 44.75,105.5 44.75,107.75 LED2.3
N$22
  Bottom 0.152: R6.2 7.5,103.25 5.25,105.5 5.25,107.75 LED1.1
N$23
  Bottom 0.152: R2.2 36.5,106.75 39.75,106.75 39.75,107.75 LED2.1
N$24
  Top 0.152: JP42.1 2.5,31.75 2.5,28 4.5,26 6,26 6,24 16,14 LED5.2
N$25
  Top 0.152: LED5.1 13.5,14 13.5,16 6,23.5 4.25,23.5 1.5,26.25 1.5,29 JP41.1
N$26  (via drill 0.3)
  Top 0.152: v8.75,82.5 6.25,85 1.5,85 JP30.1
  Bottom 0.152: v8.75,82.5 14.25,77 14.25,46.75 12.5,45 12.5,27.25 14.75,25 J2.P2
N$27
  Bottom 0.152: J12.P3 43.75,2 48,6.25 48,28 46.75,29.25 46.75,42.5 48.5,44.25 JP46.1
N$28  (via drill 0.3)
  Top 0.152: v43,35.25 44.5,36.75 48.5,36.75 JP45.1
  Bottom 0.152: v43,35.25 43,15.75 41.25,14 LED7.2
N$29  (via drill 0.3)
  Top 0.152: v42,36.75 44.5,39.25 48.5,39.25 JP44.1
  Bottom 0.152: v42,36.75 42,17.25 38.75,14 LED7.1
N$30  (via drill 0.3)
  Top 0.152: v45.25,83.75 42.25,86.75 15.5,86.75 14,85.25 R11.P$2
  Bottom 0.152: C22.1 14,81.5 14,85 R11.P$2 | JP22.1 48.5,78.25 45.25,81.5 v45.25,83.75
N$31  (via drill 0.3)
  Top 0.152: v36.75,73 45.5,73 48.5,70 JP23.1
  Bottom 0.152: R12.P$2 35.75,85 35.75,81.5 C23.1 35.75,81.25 35.75,74 v36.75,73
SHAPE_IN  (via drill 0.3)
  Top 0.152: v38,92.75 41,95.75 46.5,95.75 48.5,97.75 JP24.1
  Bottom 0.152: v38,92.75 38,91 39.75,89.25 39.75,75.5 38,73.75 38,73.25 35.75,71 35.75,46.75 37.5,45 37.5,39.75 36.75,39 36.75,18.75 35.25,17.25 J5.P3
SHIFT_IN
  Bottom 0.152: JP27.1 47.25,96.5 47.25,102.25 41.75,102.25 41.5,102 41.5,94.5 42,94 42,77.25 38.5,73.75 38.5,66.25 39.75,65 39.75,58.75 38.5,57.5 38.5,49.75 43.75,44.5 43.75,18.5 45,17.25 J6.P3
SLOPE_IN  (via drill 0.3)
  Top 0.152: v31.25,87.5 48.5,87.5 JP28.1
  Bottom 0.152: v31.25,87.5 31.25,54 27.25,50 27.25,16 24.5,16 23.75,16.75 23.75,18.5 14.5,18.5 13.75,17.75 13.75,17.25 5,17.25 J1.P3
SMOOTHNESS_IN  (via drill 0.3)
  Top 0.152: v22.75,89 23.5,89.75 45.75,89.75 48.5,92.5 JP25.1
  Bottom 0.152: v22.75,89 22.75,72.5 17.25,67 17.25,48.25 20.25,45.25 20.25,24.25 24.25,20.25 24.25,18 25,17.25 J4.P3
SW_MODE  (via drill 0.3)
  Top 0.152: v18.5,87.5 1.5,87.5 JP61.1 | SW3.4 28.25,100 21.75,100 SW3.3
  Bottom 0.152: v18.5,87.5 21.5,90.5 21.5,99.75 SW3.3
SW_RANGE  (via drill 0.3)
  Top 0.152: SW2.3 4.5,100 10.75,100 SW2.4 10.75,99.75 12.75,97.75 43,97.75 v44.25,96.5 | v46.25,69.75 48.5,67.5 JP60.1
  Bottom 0.152: v46.25,69.75 46,70 46,73.5 44,75.5 44,96.25 v44.25,96.5
SW_SHIFT  (via drill 0.3)
  Top 0.152: SW1.3 39.25,100 45.5,100 SW1.4 | v43.75,68 45.5,68 48.5,65 JP62.1
  Bottom 0.152: v43.75,68 43.5,68.25 43.5,97.75 45.5,99.75 SW1.4
TRIG_IN  (via drill 0.3)
  Top 0.152: v10.25,77.25 15.5,82.5 48.5,82.5 JP31.1
  Bottom 0.152: v10.25,77.25 10.25,75.5 11.5,74.25 11.5,66 9,63.5 9,51.75 9.75,51 9.75,37.75 10,37.5 J7.P3
V_OCT_IN  (via drill 0.3)
  Top 0.152: v45.5,43 40,37.5 J3.P3
  Bottom 0.152: v45.5,43 45.75,43.25 45.75,51.5 47.25,53 47.25,57.25 48.5,58.5 48.5,60.5 47,62 47,73 44.5,75.5 44.5,86 48.5,90 JP26.1